# Altium project CAN_BUS.PrjPcb
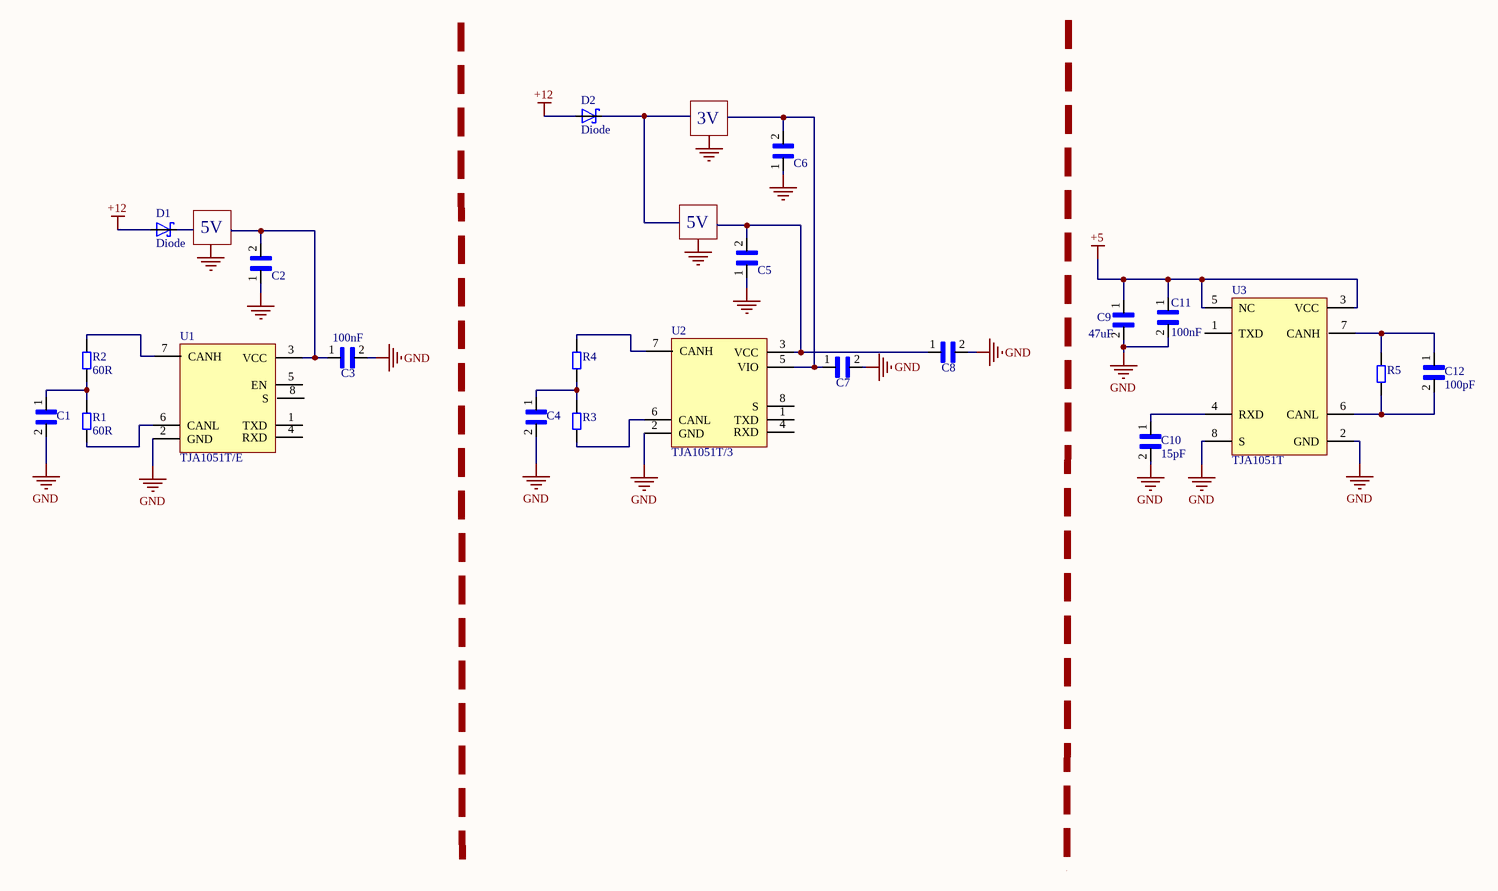
[diagram p0: TJA1051T.SchDoc]
2 sheets, 33 parts. Net scope: global (net labels, ports and power ports of the same name join across sheets).
Sheets:
  TJA1051T.SchDoc
  MCP2551T.SchDoc

## Sheet TJA1051T.SchDoc
size A3; DrawnBy: ZEHRA; Engineer: ZEHRA; SheetNumber: 1; SheetTotal: 2; PageSize: A3; Department: R&D - Hardware

### Parts
C1  CAP-0805-NP0-10nF  [CAP-0805-NP0]  (value not drawn)
C2  CAP-0805-NP0-10nF  [CAP-0805-NP0]  (value not drawn)
C3  100nF  [CAP-0805-NP0]
C4  CAP-0805-NP0-10nF  [CAP-0805-NP0]  (value not drawn)
C5  CAP-0805-NP0-10nF  [CAP-0805-NP0]  (value not drawn)
C6  CAP-0805-NP0-10nF  [CAP-0805-NP0]  (value not drawn)
C7  CAP-0805-NP0-10nF  [CAP-0805-NP0]  (value not drawn)
C8  CAP-0805-NP0-10nF  [CAP-0805-NP0]  (value not drawn)
C9  47uF  [CAP-0805-NP0]
C10  15pF  [CAP-0805-NP0]
C11  100nF  [CAP-0805-NP0]
C12  100pF  [CAP-0805-NP0]
D1  Diode  [Diode]
D2  Diode  [Diode]
R1  60R  [RES-0805]
R2  60R  [RES-0805]
R3  RES-0805-10k  [RES-0805]  (value not drawn)
R4  RES-0805-10k  [RES-0805]  (value not drawn)
R5  120R  [RES-0805]  (value not drawn)
U1  TJA1051T/E  [TJA1051T]
U2  TJA1051T/3  [TJA1051T]
U3  TJA1051T  [TJA1051T]

### Nets
+5: C9.1 C11.1 U3.3(VCC) U3.5(NC)
+12: D1.1 D2.2
GND: C1.2 C2.1 C3.2 C4.2 C5.1 C6.1 C7.2 C8.2 C9.2 C10.2 C11.2 U1.2(GND) U2.2(GND) U3.2(GND) U3.8(S)
NetC1_1: C1.1 R1.2 R2.1
NetC2_2: C2.2 C3.1 U1.3(VCC)
NetC4_1: C4.1 R3.2 R4.1
NetC5_2: C5.2 C8.1 U2.3(VCC)
NetC6_2: C6.2 C7.1 U2.5(VIO)
NetC10_1: C10.1 U3.4(RXD)
NetC12_1: C12.1 R5.2 U3.7(CANH)
NetC12_2: C12.2 R5.1 U3.6(CANL)
NetR1_1: R1.1 U1.6(CANL)
NetR2_2: R2.2 U1.7(CANH)
NetR3_1: R3.1 U2.6(CANL)
NetR4_2: R4.2 U2.7(CANH)

Not connected (* = marked no-connect by the designer): D1 2; D2 1; U1 1(TXD) 4(RXD) 5(EN) 8(S); U2 1(TXD) 4(RXD) 8(S); U3 1(TXD)

### Notes on the sheet
- 3V
- 5V
- (near C5) 5V
- Eğer besleme gerilimin 3V ise bu devre uygundur.
- D1 bağla ki batarya bağladığın için ters bağlama olmasın. C3 gerilimin dalgallanmalarını yok etmek voltajı düzgünleştimek ve entegreyi korumak için konulur.
- Genlelikle bu devre baz alınır.
- Labels drawn without touching a wire or pin: GND
- FILE NAME
- Size
- Date:
- DrawnBy:
- Department
- Revision
- Sheet of
- File:

### Library data of the parts
C1-C12 = CAP-0805-NP0-10nF: Cap Ceramic 0.01uF 50V C0G 5% Pad SMD 0805 125°C T/R; Manufacturer: Yageo; Manufacturer Part Number: CC0805JKNPO9BN103; Supplier 1: Newark; RoHS: Yes; Category: Ceramic Capacitors; Stock 1: 12000; Pricing 1: 3000=0,12400, 6000=0,10900, 12000=0,09900, 18000=0,09300, 30000=0,08600 (USD); RoHS Compliant: Yes; Supplier Part Number 1: 50AJ2782
R1-R5 = RES-0805-10k: Res SMD 0805 10K 1% 0.125W T.C.100PPM; Manufacturer: Yageo; Manufacturer Part Number: RC0805FR-0710KL; Resistance: 10kR; Temperature Coefficient: 100ppm/°C; Power Rating: 125mW; Voltage Rating: 150V; Supplier 1: Digi-Key; RoHS: Yes; Category: Chip SMD Resistors; Stock 1: 1272565; Pricing 1: 5000=0,00544 (USD); Case/Package: 0805; Case Code (Imperial): 0805; Case Code (Metric): 2012; Size Code: 0805; Min Operating Temperature: -55°C; Max Operating Temperature: 155°C; Tolerance: 1%; Resistor Type: Thick Film; Packaging: Tape and Reel; Package Quantity: 1; Termination: SMD/SMT; Number of Terminations: 2; Max Power Dissipation: 125mW; Features: Moisture Resistant; Series: RC; Construction: Rectangular; Resistance Tolerance: 1%; Technology: THICK FILM; Length: 2mm; Width: 0.049inch; Height: 0.024inch; Depth: 1.25mm; REACH SVHC: Unknown; Lead Free: Lead Free; Military Standard: Not; RoHS Compliant: Yes; Supplier Part Number 1: 311-10.0KCRTR-ND
U1 = TJA1051T/E: TJA1051 Series 5.5 V Surface Mount High-Speed CAN Transceiver - SOIC-8; Manufacturer: NXP Semiconductors; Manufacturer Part Number: TJA1051T/E,118; Max Supply Voltage: 5.5V; Min Supply Voltage: 4.5V; Number of Transceivers: 1; Data Rate: 1Mbps; Nominal Supply Current: 70mA; Operating Supply Voltage: 5V; Supplier 1: Newark; RoHS: Yes; Category: Interface ICs; Pricing 1: 1=1,43000, 10=1,29000, 25=1,23000, 50=1,12000, 100=1,01000, 250=0,93800, 500=0,82900, 1000=0,82300 (USD); Mount: Surface Mount; Case/Package: SO; Number of Pins: 8; Min Operating Temperature: -40°C; Max Operating Temperature: 150°C; Packaging: Tape and Reel; Package Quantity: 2500; Supply Current: 70mA; Radiation Hardening: No; Lead Free: Lead Free; RoHS Compliant: Yes; ComponentLink1URL: https://datasheet.ciiva.com/11212/tja1051-11212764.pdf?src-supplier=Avnet; ComponentLink1Description: https://datasheet.ciiva.com/11212/tja1051-11212764.pdf?src-supplier=Avnet; Supplier Part Number 1: 31AC7103
U2 = TJA1051T/3: TJA1051 Single 5 V 1 MBd Surface Mount High Speed CAN Transceiver - HVSON-8; Manufacturer: NXP Semiconductors; Manufacturer Part Number: TJA1051TK/3/1J; Min Supply Voltage: 4.5V; Max Supply Voltage: 5.5V; Number of Transceivers: 1; Data Rate: 5Mbps; Max Supply Current: 70mA; Simplex/Duplex: Half Duplex; Receiver Hysteresis: 120mV; Supplier 1: Newark; RoHS: Yes; Category: Interface ICs; Pricing 1: 1=1,43000, 10=1,29000, 25=1,23000, 50=1,12000, 100=1,01000, 250=0,93800, 500=0,82900, 1000=0,82300 (USD); Mount: Surface Mount; Number of Pins: 8; Contact Plating: Gold,Silver; Min Operating Temperature: -40°C; Max Operating Temperature: 150°C; Packaging: Tape and Reel; Lead Free: Lead Free; REACH SVHC: No SVHC; ComponentLink1URL: http://www.farnell.com/datasheets/1931504.pdf?src-supplier=Farnell; ComponentLink1Description: http://www.farnell.com/datasheets/1931504.pdf?src-supplier=Farnell; ComponentLink2URL: http://www.farnell.com/datasheets/1931504.pdf?src-supplier=Element14; ComponentLink2Description: http://www.farnell.com/datasheets/1931504.pdf?src-supplier=Element14; ComponentLink3URL: http://www.nxp.com/documents/data_sheet/TJA1051.pdf?src-supplier=Avnet; ComponentLink3Description: http://www.nxp.com/documents/data_sheet/TJA1051.pdf?src-supplier=Avnet; Supplier Part Number 1: 85Y0318
U3 = TJA1051T: CAN 1Mbps Normal/Silent 5V 8-Pin SO Tube; Manufacturer: NXP Semiconductors; Number of Transceivers: 1; Max Supply Voltage: 5.5V; Min Supply Voltage: 4.5V; Max Supply Current: 70mA; Supplier 1: RSComponents; Manufacturer Part Number: TJA1051T; RoHS: Yes; Mount: Surface Mount; Case/Package: SOIC; Number of Pins: 8; Min Operating Temperature: -40°C; Max Operating Temperature: 150°C; Length: 5mm; Width: 4mm; Height: 1.45mm; RoHS Compliant: Yes; Supplier Part Number 1: 1242432

## Sheet MCP2551T.SchDoc
size A3; DrawnBy: ZEHRA; Engineer: ZEHRA; SheetNumber: 1; SheetTotal: 1; PageSize: A3; Department: R&D - Hardware
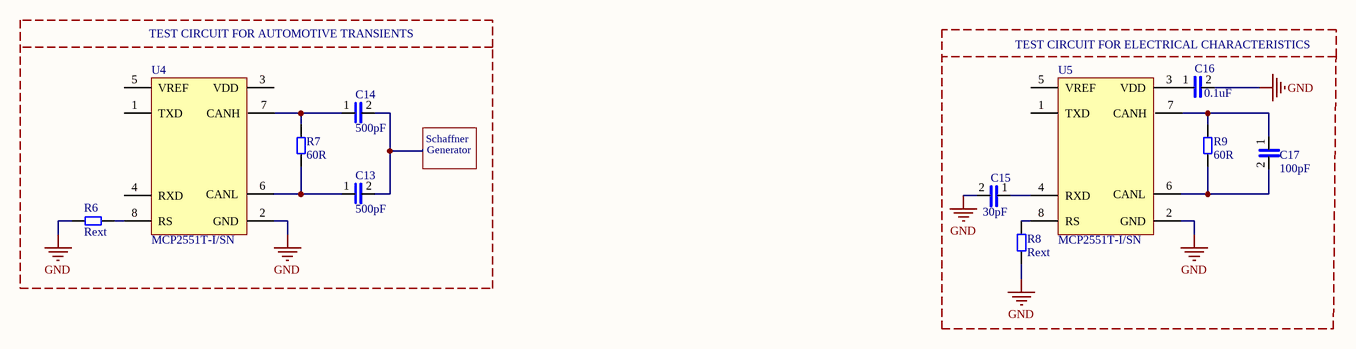
[diagram p1: MCP2551T.SchDoc]

### Parts
C13  500pF  [CAP-0805-NP0]
C14  500pF  [CAP-0805-NP0]
C15  30pF  [CAP-0805-NP0]
C16  0.1uF  [CAP-0805-NP0]
C17  100pF  [CAP-0805-NP0]
R6  Rext  [RES-0805]
R7  60R  [RES-0805]
R8  Rext  [RES-0805]
R9  60R  [RES-0805]
U4  MCP2551T-I/SN  [MCP2551T]
U5  MCP2551T-I/SN  [MCP2551T]

### Nets
GND: C15.2 C16.2 R6.1 R8.1 U4.2(GND) U5.2(GND)
NetC13_1: C13.1 R7.1 U4.6(CANL)
NetC13_2: C13.2 C14.2
NetC14_1: C14.1 R7.2 U4.7(CANH)
NetC15_1: C15.1 U5.4(RXD)
NetC16_1: C16.1 U5.3(VDD)
NetC17_1: C17.1 R9.2 U5.7(CANH)
NetC17_2: C17.2 R9.1 U5.6(CANL)
NetR6_2: R6.2 U4.8(RS)
NetR8_2: R8.2 U5.8(RS)

Not connected (* = marked no-connect by the designer): U4 1(TXD) 3(VDD) 4(RXD) 5(VREF); U5 1(TXD) 5(VREF)

### Notes on the sheet
- TEST CIRCUIT FOR AUTOMOTIVE TRANSIENTS
- TEST CIRCUIT FOR ELECTRICAL CHARACTERISTICS
- Generator
- Schaffner
- (near U4) RS may be connected to VDD or GND
- (near U5) RS may be connected to VDD or GND
- FILE NAME
- Size
- Date:
- DrawnBy:
- Department
- Revision
- Sheet of
- File:

### Library data of the parts
C13-C17 = CAP-0805-NP0-3.3nF: CAP CER 3300PF 50V NPO 0805; Manufacturer: Yageo; Manufacturer Part Number: CC0805JKNPO9BN332; Tolerance: 5%; Capacitance: 3.3nF; Dielectric: C0G; Supplier 1: Digi-Key; RoHS: Yes; Category: Ceramic Capacitors; Stock 1: 11274; Pricing 1: 1=0,42000, 10=0,29300, 50=0,20540, 100=0,17600, 500=0,13200, 1000=0,11146 (USD); Mount: Surface Mount; Case/Package: 0805; Min Operating Temperature: -55°C; Max Operating Temperature: 125°C; Packaging: Tape and Reel; Voltage Rating (DC): 50V; Resistor Type: Ceramic; Voltage Rating: 50V; Series: CC; Length: 0.079inch; Width: 0.049inch; Thickness: 0.057inch; Depth: 1.25mm; RoHS Compliant: Yes; ComponentLink1URL: https://datasheet.ciiva.com/13210/upy-gp-np0-16v-to-50v-8-13210153.pdf?src-supplier=Mouser; ComponentLink1Description: https://datasheet.ciiva.com/13210/upy-gp-np0-16v-to-50v-8-13210153.pdf?src-supplier=Mouser; Supplier Part Number 1: 311-4211-1-ND
R6-R9 = RES-0805-10k: as R1 on sheet TJA1051T; Supplier 1: Digi-Key; RoHS: Yes; Category: Chip SMD Resistors; Stock 1: 1272565; Pricing 1: 5000=0,00544 (USD); Case/Package: 0805; Case Code (Imperial): 0805; Case Code (Metric): 2012; Size Code: 0805; Min Operating Temperature: -55°C; Max Operating Temperature: 155°C; Tolerance: 1%; Resistor Type: Thick Film; Packaging: Tape and Reel; Package Quantity: 1; Termination: SMD/SMT; Number of Terminations: 2; Max Power Dissipation: 125mW; Features: Moisture Resistant; Series: RC; Construction: Rectangular; Resistance Tolerance: 1%; Technology: THICK FILM; Length: 2mm; Width: 0.049inch; Height: 0.024inch; Depth: 1.25mm; REACH SVHC: Unknown; Lead Free: Lead Free; Military Standard: Not; RoHS Compliant: Yes; Supplier Part Number 1: 311-10.0KCRTR-ND
U4 U5 = MCP2551T-I/SN: 1/1 Transceiver Half CAN 8-SOIC; Manufacturer: Microchip; Manufacturer Part Number: MCP2551-I/SN; Number of Terminals/Pins: 8; Package Body Material: Plastic; Interface: CAN,Serial; Operating Supply Voltage: 5V; Data Rate: 1Mbps; Max Supply Voltage: 5.5V; Min Supply Voltage: 4.5V; Nominal Supply Current: 75mA; Number of Transceivers: 1; Slew Rate: 8.5V/µs; Time @ Peak Reflow Temperature-Max (s): 40s; Supplier 1: Arrow Electronics; RoHS: Yes; Category: Interface ICs; Stock 1: 5; Pricing 1: 1=1,81530, 10=1,63500, 25=1,27120 (USD); Mount: Surface Mount; Case/Package: SOIC; Number of Pins: 8; Contact Plating: Tin,Matte; Package Shape: Rectangular; Terminal Finish: Tin; Min Operating Temperature: -40°C; Max Operating Temperature: 85°C; Package Quantity: 100; Packaging: Rail/Tube; Max Supply Current: 75mA; Number of Drivers: 1; Number of Receivers: 1; Supply Current: 75mA; Number of Transmit Buffers: 1; Number of Receive Buffers: 1; Supply Voltage-Nom: 5.5V; Logic Function: Transceiver; Number of Functions: 1; JESD-30 Code: R-PDSO-G8; Moisture Sensitivity Level: 1; Peak Reflow Temperature (Cel): 260°C; Surface Mount: Yes; Terminal Form: Gull Wing; Terminal Position: DUAL; Length: 4.9mm; Width: 3.9mm; Height: 1.25mm; Radiation Hardening: No; REACH SVHC: No SVHC; Lead Free: Lead Free; RoHS Compliant: Yes; Temperature Grade: INDUSTRIAL; ComponentLink1URL: https://datasheet.ciiva.com/27056/2040583-27056423.pdf?src-supplier=Jameco; ComponentLink1Description: https://datasheet.ciiva.com/27056/2040583-27056423.pdf?src-supplier=Jameco; ComponentLink2URL: https://datasheet.ciiva.com/8084/jp011797-8084592.pdf?src-supplier=Avnet; ComponentLink2Description: https://datasheet.ciiva.com/8084/jp011797-8084592.pdf?src-supplier=Avnet; ComponentLink3URL: https://datasheet.ciiva.com/14152/eb644223-644224-e-14152540.pdf?src-supplier=Distrelec; ComponentLink3Description: https://datasheet.ciiva.com/14152/eb644223-644224-e-14152540.pdf?src-supplier=Distrelec; ComponentLink4URL: https://datasheet.ciiva.com/1495/21667f-1495089.pdf?src-supplier=Element14; ComponentLink4Description: https://datasheet.ciiva.com/1495/21667f-1495089.pdf?src-supplier=Element14; ComponentLink5URL: https://datasheet.ciiva.com/1700/21667f-1700023.pdf?src-supplier=Digi-Key; ComponentLink5Description: https://datasheet.ciiva.com/1700/21667f-1700023.pdf?src-supplier=Digi-Key; Supplier Part Number 1: MCP2551-I/SN

## Nets that join several sheets
GND: TJA1051T (15 pins), MCP2551T (6 pins)